# Altium schematic sheet Controller2.SchDoc
size 420 x 297 mm; SheetNumber: 1; SheetTotal: 1
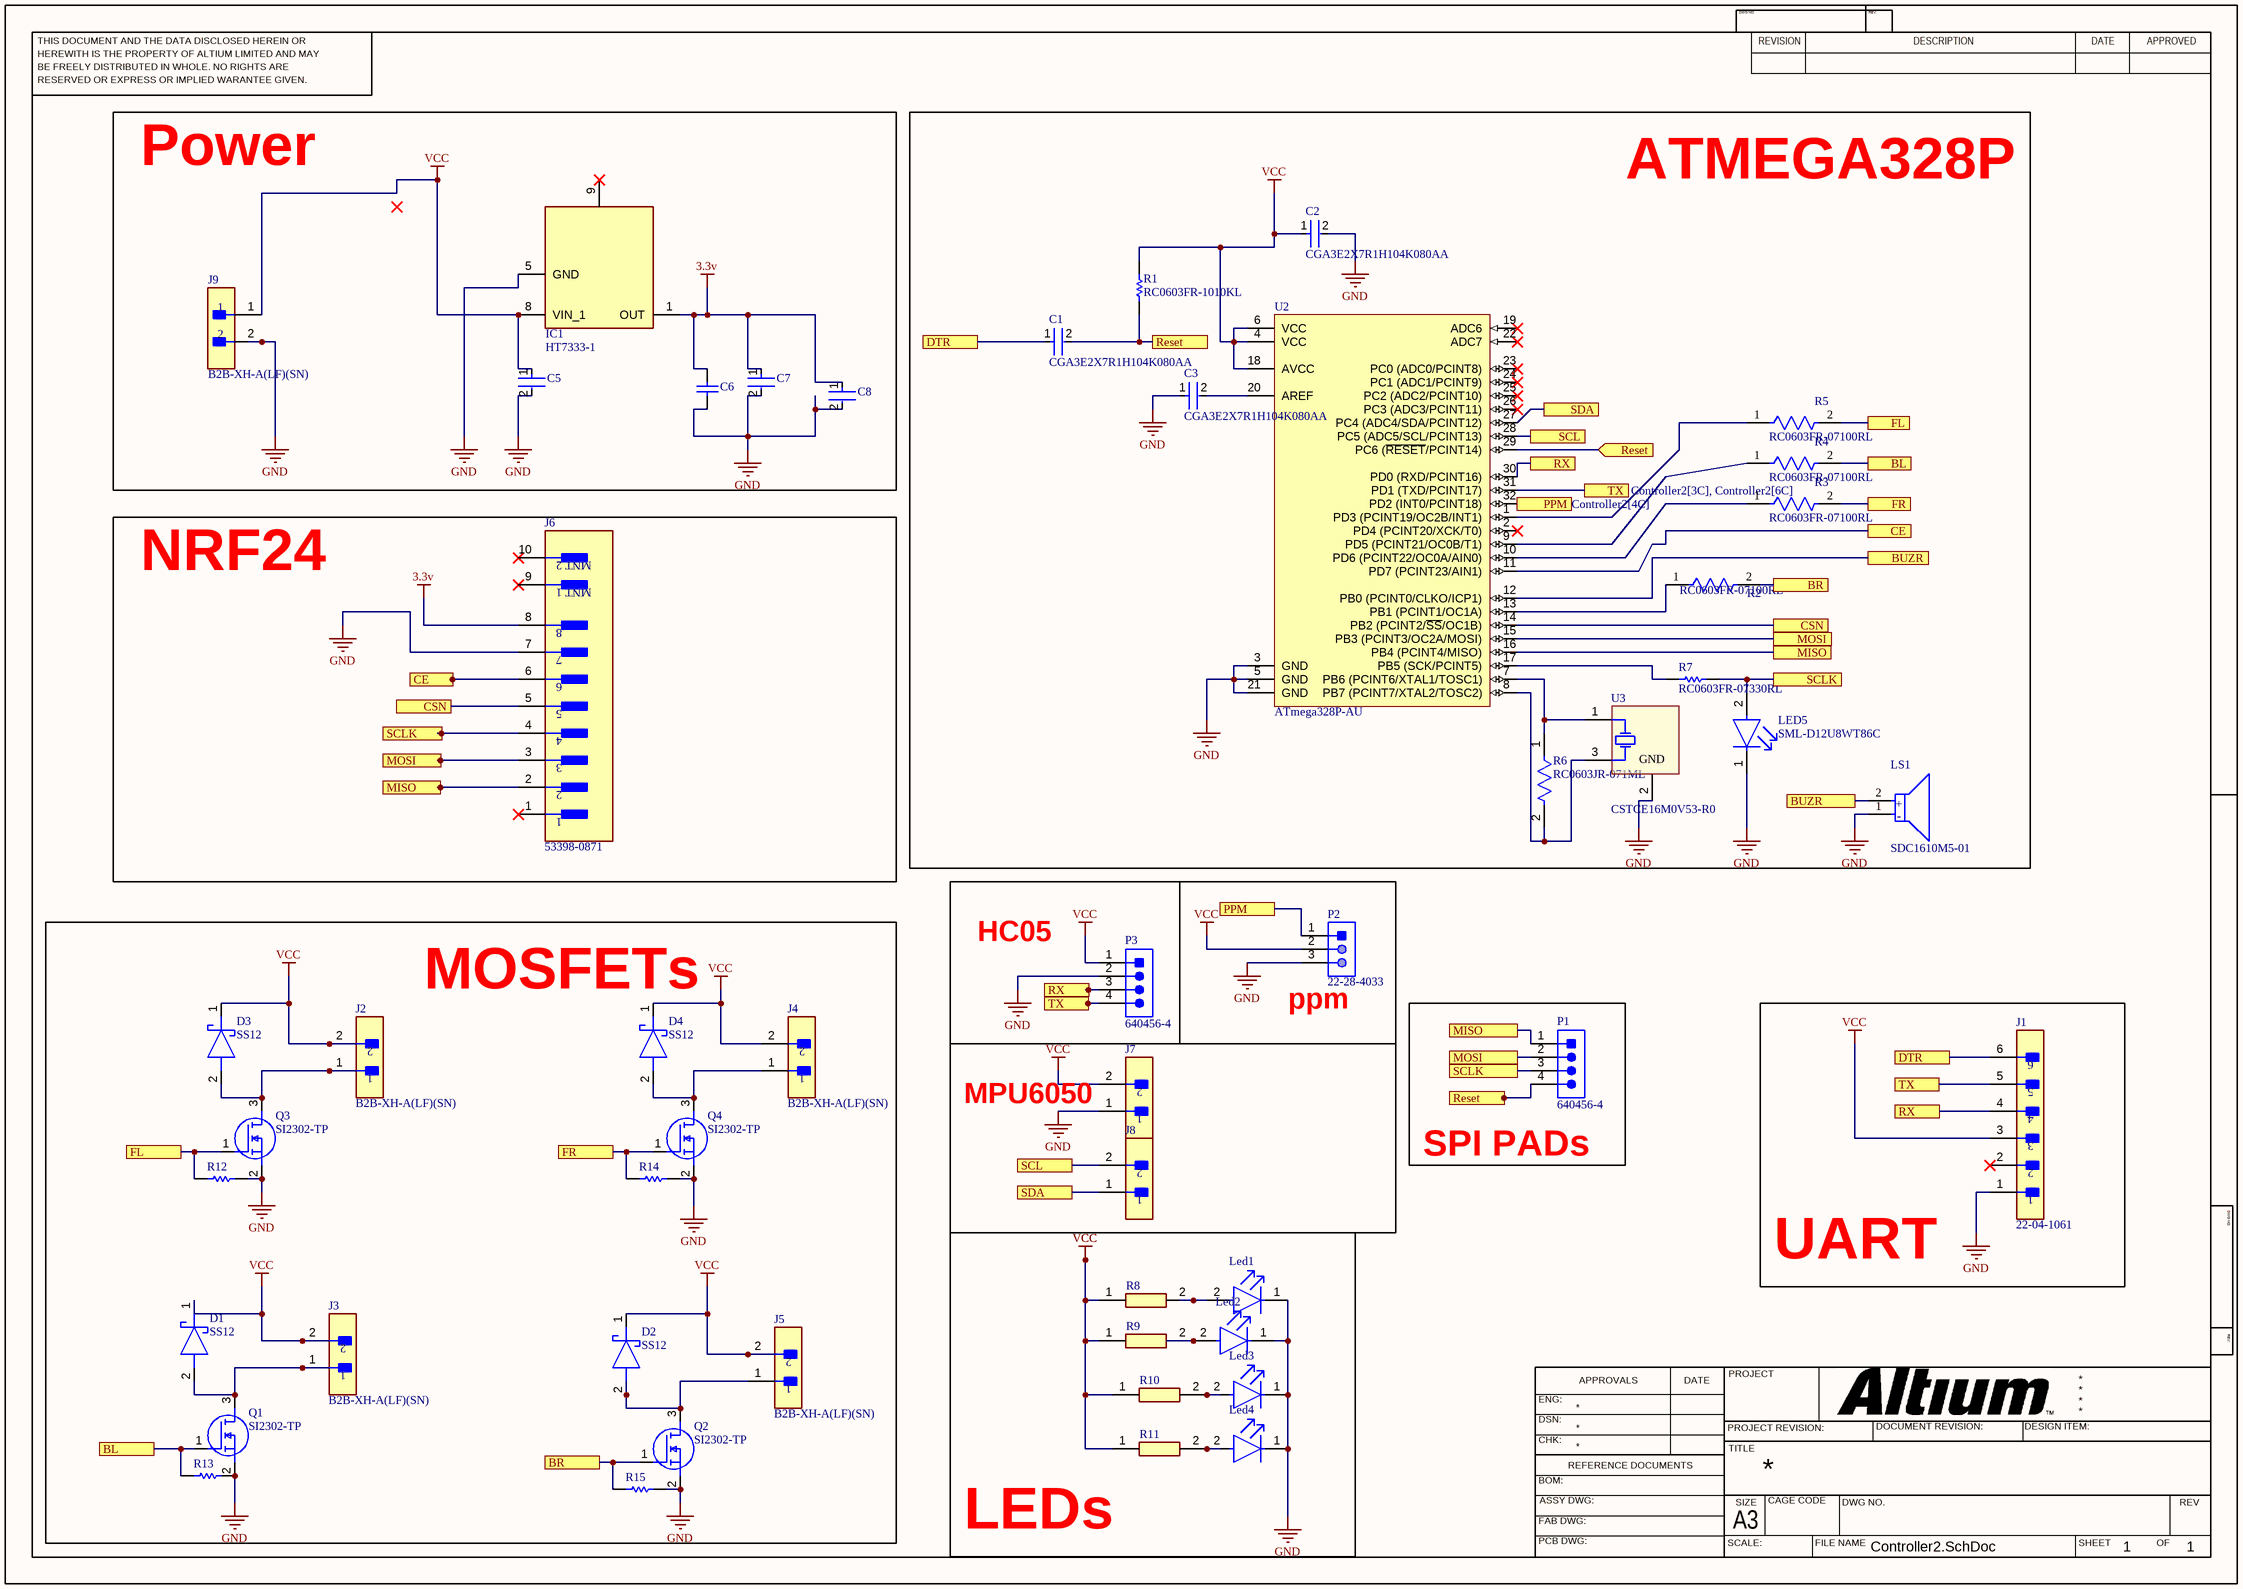
[diagram p0: Controller2.SchDoc]

## Parts
C1  CGA3E2X7R1H104K080AA  [FP-CGA3E-0_3-0_1-IPC_A]
C2  CGA3E2X7R1H104K080AA  [FP-CGA3E-0_3-0_1-IPC_A]
C3  CGA3E2X7R1H104K080AA  [FP-CGA3E-0_3-0_1-IPC_A]
C5  GRM188R60J106ME47D  [FP-GRM188-0_1-e0_2_0_55-IPC_A]  (value not drawn)
C6  GRM188R71H104KA93D  [CAPC1608X90X35ML10T15]  (value not drawn)
C7  GRM188R60J106ME47D  [FP-GRM188-0_1-e0_2_0_55-IPC_A]  (value not drawn)
C8  GRM188R60J106ME47D  [FP-GRM188-0_1-e0_2_0_55-IPC_A]  (value not drawn)
D1  SS12  [DIOM5227X250N]
D2  SS12  [DIOM5227X250N]
D3  SS12  [DIOM5227X250N]
D4  SS12  [DIOM5227X250N]
IC1  HT7333-1  [SOIC127P600X175-9N]
J1  22-04-1061  [FP-22-04-1061-MFG]
J2  B2B-XH-A(LF)(SN)  [FP-B2B-XH-A_LF_SN-MFG]
J3  B2B-XH-A(LF)(SN)  [FP-B2B-XH-A_LF_SN-MFG]
J4  B2B-XH-A(LF)(SN)  [FP-B2B-XH-A_LF_SN-MFG]
J5  B2B-XH-A(LF)(SN)  [FP-B2B-XH-A_LF_SN-MFG]
J6  53398-0871  [FP-53398-0871-MFG]
J7  B2B-XH-A(LF)(SN)  [FP-B2B-XH-A_LF_SN-MFG]  (value not drawn)
J8  B2B-XH-A(LF)(SN)  [FP-B2B-XH-A_LF_SN-MFG]  (value not drawn)
J9  B2B-XH-A(LF)(SN)  [FP-B2B-XH-A_LF_SN-MFG]
Led1  SML-D12U8WT86C  [FP-SML-D12-MFG]  (value not drawn)
Led2  SML-D12U8WT86C  [FP-SML-D12-MFG]  (value not drawn)
Led3  SML-D12U8WT86C  [FP-SML-D12-MFG]  (value not drawn)
Led4  SML-D12U8WT86C  [FP-SML-D12-MFG]  (value not drawn)
LED5  SML-D12U8WT86C  [FP-SML-D12-MFG]
LS1  SDC1610M5-01  [FP-SDC1610M5-01-MFG]
P1  640456-4  [TECO-640456-4]
P2  22-28-4033  [MOLX-22-28-4033_V]
P3  640456-4  [TECO-640456-4]
Q1  SI2302-TP  [SOT95P237X125-3N]
Q2  SI2302-TP  [SOT95P237X125-3N]
Q3  SI2302-TP  [SOT95P237X125-3N]
Q4  SI2302-TP  [SOT95P237X125-3N]
R1  RC0603FR-1010KL  [RESC1608X55X25LL10T15]
R2  RC0603FR-07100RL  [FP-RC0603-0_55-MFG]
R3  RC0603FR-07100RL  [FP-RC0603-0_55-MFG]
R4  RC0603FR-07100RL  [FP-RC0603-0_55-MFG]
R5  RC0603FR-07100RL  [FP-RC0603-0_55-MFG]
R6  RC0603JR-071ML  [FP-RC0603-0_55-IPC_C]
R7  RC0603FR-07330RL  [RESC1608X55X25NL10T15]
R8  TFCR0603-16W-E-3300BT  [TFCR0603]  (value not drawn)
R9  TFCR0603-16W-E-3300BT  [TFCR0603]  (value not drawn)
R10  TFCR0603-16W-E-3300BT  [TFCR0603]  (value not drawn)
R11  TFCR0603-16W-E-3300BT  [TFCR0603]  (value not drawn)
R12  CRCW060310K0FKEA  [RESC1609X50X30NL8T20]  (value not drawn)
R13  CRCW060310K0FKEA  [RESC1609X50X30NL8T20]  (value not drawn)
R14  CRCW060310K0FKEA  [RESC1609X50X30NL8T20]  (value not drawn)
R15  CRCW060310K0FKEA  [RESC1609X50X30NL8T20]  (value not drawn)
U2  ATmega328P-AU  [32A_M]
U3  CSTCE16M0V53-R0  [MURA-CSTCE_V-3_V]

## Blocks framed on the sheet
Power: C5-C8 IC1 J9
ATMEGA328P: C1-C3 LED5 LS1 R1-R7 U2 U3
NRF24: J6
MOSFETs: D1-D4 J2-J5 Q1-Q4 R12-R15
SPI PADs: P1
UART: J1
LEDs: Led1-Led4 R8-R11

## Ports
BL (see Controller2[1D]), BL (see Controller2[6B]), BR (see Controller2[2D]), BR (see Controller2[5B]), BUZR (see Controller2[5C]), BUZR (see Controller2[6B]), CE (see Controller2[2B]), CE (see Controller2[6B]), CSN (see Controller2[2B]), CSN (see Controller2[5B]), DTR (see Controller2[3A]), DTR (see Controller2[6C]), FL (see Controller2[1C]), FL (see Controller2[6B]), FR (see Controller2[2C]), FR (see Controller2[6B]), MISO (see Controller2[2B], Controller2[4C]), MISO (see Controller2[2B], Controller2[5B]), MISO (see Controller2[4C], Controller2[5B]), MOSI (see Controller2[2B], Controller2[4C]), MOSI (see Controller2[2B], Controller2[5B]), MOSI (see Controller2[4C], Controller2[5B]), PPM (see Controller2[4C]), PPM (see Controller2[5B]), Reset (in, see Controller2[4A], Controller2[4C]), Reset (see Controller2[4A], Controller2[5B]), Reset (see Controller2[4C], Controller2[5B]), RX (see Controller2[3C], Controller2[5B]), RX (see Controller2[3C], Controller2[6C]), RX (see Controller2[5B], Controller2[6C]), SCL (see Controller2[3C]), SCL (see Controller2[5B]), SCLK (see Controller2[2B], Controller2[4C]), SCLK (see Controller2[2B], Controller2[5B]), SCLK (see Controller2[4C], Controller2[5B]), SDA (see Controller2[3D]), SDA (see Controller2[5B]), TX (see Controller2[3C], Controller2[5B]), TX (see Controller2[3C], Controller2[6C]), TX (see Controller2[5B], Controller2[6C])

## Nets
3.3v: C6.2 C7.1 C8.1 IC1.1(OUT) J6.8
GND: C2.2 C3.1 C5.2 C6.1 C7.2 C8.2 IC1.5(GND) J1.1 J6.7 J7.1 J9.2 Led1.1(C) Led2.1(C) Led3.1(C) Led4.1(C) LED5.1(C) LS1.1(C) P2.3 P3.2 Q1.2(S) Q2.2(S) Q3.2(S) Q4.2(S) R12.2 R13.2 R14.2 R15.2 U2.3(GND) U2.5(GND) U2.21(GND) U3.2(GND)
VCC: C2.1 C5.1 D1.1(K) D2.1(K) D3.1(K) D4.1(K) IC1.8(VIN_1) J1.3 J2.2 J3.2 J4.2 J5.2 J7.2 J9.1 P2.2 P3.1 R1.2 R8.1 R9.1 R10.1 R11.1 U2.4(VCC) U2.6(VCC) U2.18(AVCC)
BL: Q1.1(G) R4.2 R13.1 ; port BL
BR: Q2.1(G) R2.2 R15.1 ; port BR
BUZR: LS1.2(A) U2.12(PB0_(PCINT0/CLKO/ICP1)) ; port BUZR
CE: J6.6 U2.11(PD7_(PCINT23/AIN1)) ; port CE
CSN: J6.5 U2.14(PB2_(PCINT2/~{SS}/OC1B)) ; port CSN
DTR: C1.1 J1.6 ; port DTR
FL: Q3.1(G) R5.2 R12.1 ; port FL
FR: Q4.1(G) R3.2 R14.1 ; port FR
MISO: J6.2 P1.1 U2.16(PB4_(PCINT4/MISO)) ; port MISO
MOSI: J6.3 P1.2 U2.15(PB3_(PCINT3/OC2A/MOSI)) ; port MOSI
PPM: P2.1 U2.32(PD2_(INT0/PCINT18)) ; port PPM
Reset: C1.2 P1.4 R1.1 U2.29(PC6_(~{RESET}/PCINT14)) ; port Reset
RX: J1.4 P3.3 U2.30(PD0_(RXD/PCINT16)) ; port RX
SCL: J8.2 U2.28(PC5_(ADC5/SCL/PCINT13)) ; port SCL
SCLK: J6.4 LED5.2(A) P1.3 R7.2 ; port SCLK
SDA: J8.1 U2.27(PC4_(ADC4/SDA/PCINT12)) ; port SDA
TX: J1.5 P3.4 U2.31(PD1_(TXD/PCINT17)) ; port TX
NetC3_2: C3.2 U2.20(AREF)
NetD1_2: D1.2(A) J3.1 Q1.3(D)
NetD2_2: D2.2(A) J5.1 Q2.3(D)
NetD3_2: D3.2(A) J2.1 Q3.3(D)
NetD4_2: D4.2(A) J4.1 Q4.3(D)
NetLed1_2: Led1.2(A) R8.2
NetLed2_2: Led2.2(A) R9.2
NetLed3_2: Led3.2(A) R10.2
NetLed4_2: Led4.2(A) R11.2
NetR2_1: R2.1 U2.13(PB1_(PCINT1/OC1A))
NetR3_1: R3.1 U2.10(PD6_(PCINT22/OC0A/AIN0))
NetR4_1: R4.1 U2.9(PD5_(PCINT21/OC0B/T1))
NetR5_1: R5.1 U2.1(PD3_(PCINT19/OC2B/INT1))
NetR6_1: R6.1 U2.7(PB6_(PCINT6/XTAL1/TOSC1)) U3.1(C1)
NetR6_2: R6.2 U2.8(PB7_(PCINT7/XTAL2/TOSC2)) U3.3(C2)
NetR7_1: R7.1 U2.17(PB5_(SCK/PCINT5))

Not connected (* = marked no-connect by the designer): IC1 9(VIN_2)*; J1 2*; J6 1* 9(MNT_1)* 10(MNT_2)*; U2 2(PD4_(PCINT20/XCK/T0))* 19(ADC6)* 22(ADC7)* 23(PC0_(ADC0/PCINT8))* 24(PC1_(ADC1/PCINT9))* 25(PC2_(ADC2/PCINT10))* 26(PC3_(ADC3/PCINT11))*

## Notes on the sheet
- HC05
- (near P2) ppm
- MPU6050
- THIS DOCUMENT AND THE DATA DISCLOSED HEREIN OR
- HEREWITH IS THE PROPERTY OF ALTIUM LIMITED AND MAY
- DWG NO:
- REVISION
- REV:
- DESCRIPTION
- DATE
- APPROVED
- BE FREELY DISTRIBUTED IN WHOLE. NO RIGHTS ARE
- RESERVED OR EXPRESS OR IMPLIED WARANTEE GIVEN.
- ENG:
- APPROVALS
- PROJECT
- DSN:
- CHK:
- REFERENCE DOCUMENTS
- PROJECT REVISION:
- TITLE
- DOCUMENT REVISION:
- DESIGN ITEM:
- BOM:
- FAB DWG:
- PCB DWG:
- ASSY DWG:
- SCALE:
- A3
- SIZE
- CAGE CODE
- FILE NAME
- DWG NO.
- SHEET
- OF
- REV
- (in symbol CMP-08413-000008-1) +; -

## Library data of the parts
C1-C3 = CMP-2000-07546-2: Cap Ceramic 100nF 50V X7R 10% Pad SMD 0603 +125°C Automotive T/R; Weight: 7.1E-05oz; Composition: Ceramic; Max Operating Temperature: 125°C; Termination: SMD/SMT; Dielectric: X7R; Length: 1.6mm; Package Quantity: 1; REACH SVHC: No SVHC; Lead Free: Lead Free; Case Code (Metric): 1608; Min Operating Temperature: -55°C; Packaging: Tape and Reel; Tolerance: 10%; Voltage Rating: 50V; Case Code (Imperial): 0603; Capacitance: 100nF; Case/Package: 0603; Voltage Rating (DC): 50V; Depth: 0.8mm; Radiation Hardening: No; Ratings: AEC-Q200; Mount: Surface Mount; Voltage: 50V; Thickness: 0.035inch; Width: 0.8mm; Height: 0.8mm
C5 C7 C8 = CMP-2006-02792-2: Chip Multilayer Ceramic Capacitors for General Purpose, 0603, 10uF, X5R, 15%, 20%, 6.3V; Packaging: Tape and Reel; Voltage Rating (DC): 6.3V; Width: 0.031inch; Termination: SMD/SMT; Dielectric: X5R; Package Quantity: 4000; Voltage Rating: 6.3V; Capacitance: 10uF; Case/Package: 0603; Min Operating Temperature: -55°C; Voltage: 6.3V; Length: 1.6mm; Thickness: 0.035inch; Lead Free: Lead Free; Depth: 0.8mm; Case Code (Imperial): 0603; Max Operating Temperature: 85°C; Material: Ceramic; Height: 0.8mm; Tolerance: 20%; Mount: Surface Mount; REACH SVHC: No SVHC; Radiation Hardening: No; Case Code (Metric): 1608
C6 = CMP-2100-03643-1: Chip Capacitor, 0.1 uF, +/- 10%, 50 V, -55 to 125 degC, 0603 (1608 Metric), RoHS, Tape and Reel; Manufacturer: Murata; Dielectric Material: Ceramic; Voltage Rating: 50V; Capacitance: 100nF; Dielectric: X7R; Insulation Resistance: 10GR; Case Code (Metric): 1608; Lead Free: LeadFree; Depth: 0.8mm; Number of Pins: 2; Radiation Hardening: No; Case/Package: 0603; Manufacturer URL: http://www.murata.com/; Packaging: TapeandReel; Length: 1.6mm; Contact Plating: Tin; Datasheet URL: http://psearch.en.murata.com/capacitor/product/GRM188R71H104KA93%23.pdf; Tolerance: 10%; Case Code (Imperial): 0603; Min Operating Temperature: -55degC; RoHSCompliant: true; Voltage: 50V; Termination: SMD/SMT; Mount: SurfaceMount; Material: Ceramic; Package Quantity: 1; Height: 0.8mm; Thickness: 0.035inch; REACH SVHC: NoSVHC; Max Operating Temperature: 125degC; Width: 0.8mm; Package Reference: 0603; Voltage Rating (DC): 50V; Datasheet Version: 42675.0; Package Description: 2-Pin Surface Mount Device, Body 1.6 x 0.8 mm
D1-D4 = SS12: Schottky Diode; Manufacturer_Name: onsemi; Datasheet Link: https://datasheet.datasheetarchive.com/originals/distributors/Datasheets-24/DSA-463612.pdf; Height: 2.5mm; Manufacturer_Part_Number: SS12; Mouser Part Number: 512-SS12; Mouser Price/Stock: https://www.mouser.co.uk/ProductDetail/onsemi-Fairchild/SS12?qs=mVVXn4M53U9WoaEpU1CO0A%3D%3D; Arrow Part Number: SS12; Arrow Price/Stock: https://www.arrow.com/en/products/ss12/on-semiconductor?utm_currency=USD&region=nac
IC1 = HT7333-1: Integrated Circuit; Manufacturer_Name: Holtek; Datasheet Link: https://www.holtek.com/webapi/116711/HT73xx-1v120.pdf; Height: 1.75mm; Manufacturer_Part_Number: HT7333-1
J1 = CMP-04776-000934-1: CONN HEADER VERT 6POS 2.5MM; Number of Positions: 6; Contact Resistance: 20mR; Insulation Resistance: 1GR; Glow Wire Compliant: Non-compliant; Current Rating: 3A; Max Voltage Rating (DC): 250.25kV; Voltage Rating (AC): 250V; Connector Type: Male Pin; Gender: Male; Hole Diameter: 1.19mm; Termination: Solder; Number of Circuits: 6; Number of Rows: 1; Mount: Through Hole; Lead Free: Lead Free; Contact Type: Male Pin; Lead Pitch: 2.5mm; Radiation Hardening: No; Packaging: Bulk; Pitch: 2.5mm; Contact Plating: Tin; Housing Color: Natural; Fastening Type: Friction; Contact Gender: Male; Length: 14.5mm; Orientation: Straight; Series: KK® 5045; Number of Contacts: 6; Halogen Free: Low Halogen; Min Operating Temperature: -40°C; Number of Poles: 6; Width: 5.8mm; Housing Material: Nylon; Max Operating Temperature: 105°C; Contact Material: Brass; Flammability Rating: UL94 V-0; Color: Natural; Contact Mating Length: 0.295inch; Working Voltage: 250V; Voltage Rating: 250V; Package Quantity: 1; Height: 11.7mm; Voltage Rating (DC): 250V
J2-J5 J7-J9 = CMP-2000-05888-3: CONN HEADER VERT 2POS 2.5MM; Current Rating: 3A; Voltage Rating: 250V; Number of Contacts: 2; Contact Resistance: 20mR; Wire/Cable Gauge: 22AWG; Insulation Resistance: 1GR; Connector Type: Male Pin; Packaging: Bulk; Contact Material: Brass; Lead Free: Lead Free; Orientation: Straight; Contact Plating: Tin; Max Current Rating: 3A; Termination: Solder; Fastening Type: Detent; Depth: 5.75mm; Housing Material: Polyamide; REACH SVHC: No SVHC; Series: XH; Voltage Rating (AC): 250V; Number of Positions: 2; Color: Natural; Contact Type: Male Pin; Max Voltage Rating (DC): 250V; Pitch: 2.5mm; Lead Pitch: 2.5mm; Mount: Through Hole; Max Operating Temperature: 85°C; Length: 7.4mm; Max Voltage Rating (AC): 250V; Min Operating Temperature: -25°C; Number of Rows: 1; Housing Color: White
J6 = CMP-04776-000009-1: CONN HEADER SMD 8POS 1.25MM; Manufacturer: Molex; Current Rating: 1A; Conn Gender: Male; Number Of Contacts: 8; Standoff Height: 0.05mm; Voltage Rating: 125V; Conn Orientation: Vertical; Package: 0; Lead Free: Yes; Number Of Rows: 1; Device Class L1: Connectors; Pitch: 1.25mm; Temperature Range High: +105°C; Automotive: No; ComponentLink2Description: Datasheet; Temperature Range Low: -40°C; RoHS: TRUE; Mouser Description: Headers & Wire Housings VERTICAL HDR SMT 8P; Ambient Temperature Range Low: -40°C; Octopart: https://octopart.com/53398-0871-molex-655298; Device Class L2: Headers and Wire Housings; Temperature: -40°C to +105°C; Footprint Url: https://www.molex.com/pdm_docs/sd/533980871_sd.pdf; Device Class L3: unset; ComponentLink2URL: https://www.molex.com/pdm_docs/ps/PS-51021-024-001.pdf; Contact Material: Tin,Nickel; Ambient Temperature Range High: +105°C; Height: 4.9mm; Manufacturer Part Number: 53398-0871; Digikey Description: CONN HEADER SMD 8POS 1.25MM; Category: Conn
Led1-Led4 LED5 = CMP-08952-000014-1: LED RED 1608 SMD; Manufacturer: Rohm; Reverse Voltage: 5V; Wavelength: 620nm; Luminous Intensity: 63mcd; Automotive Grade: Grade 3; Forward Voltage: 2.2V; Led Orientation: Top View; Forward Current: 20mA; Power Dissipation: 54mW; Mouser Description: LED Uni-Color Red Automotive 2-Pin Chip 0603(1608Metric) T/R; Colour: Red; ComponentLink2Description: Datasheet; Category: Diode; Package: SML-D12; RoHS: TRUE; Temperature Range Low: -40°C; Lead Free: Yes; Height: 0.65mm; Manufacturer Part Number: SML-D12U8WT86C; Digikey Description: LED RED 1608 SMD; Octopart: https://octopart.com/sml-d12u8wt86c-rohm-77740214; Device Class L3: unset; Temperature Range High: +85°C; Device Class L1: Optoelectronics; ComponentLink2URL: https://fscdn.rohm.com/en/products/databook/datasheet/opto/led/chip_mono/sml-d12x8(c)-e.pdf; Device Class L2: LEDs; Temperature: -40°C to +85°C; Automotive: Yes
LS1 = CMP-08413-000008-1: AUDIO MAGNETIC INDICATOR 4-8V TH; Nominal Supply Voltage (DC): 5V; Input Type: DC; Max Supply Current: 30mA; Number of Terminals/Pins: 2; Frequency: 2.4kHz; Lead Free: Lead Free; Operating Supply Current: 30mA; Sensing Method: Magnetic; Termination: PC Pins; Number of Pins: 2; Mount: Through Hole; Min Operating Temperature: -10°C; Diameter: 16mm; Series: SDC; Max Operating Temperature: 70°C; Packaging: Tray; Voltage Rating: 5V; Height: 10mm
P1 P3 = CMP-2000-05419-1: Male Header, Pitch 2.54 mm, 1 x 4 Position, Height 10.03 mm, Tail Length 3.56 mm, RoHS, Bulk; Manufacturer: TE Connectivity; Material, Housing: Polyester; Primary Type: InterconnectSystem; Mount Angle: Vertical; Color, Housing: White; Current, Rating: 5 / A; Agency Approvals: CSA,UL; Contact Termination Area Plating: Tin; Temperature, Operating: -55to+105 / degC; Standards: RoHSCompliant,ELVCompliant,UL94V-0; Number of Positions: 4; Brand/Series: MTA-100Series; Angle: Straight; Pin Spacing: 0.1 / "; Material, Contact: CopperAlloy; Connector Type: MTA-100; Special Features: Pinstrip; Mounting Hole Size: 0.04 / "; Contact Centerline Spacing: 0.100 / in.; Voltage, Rating: 250 / V; Manufacturer URL: http://www.te.com/; Length, Pin: 0.14 / "; Length, Overall: 0.4 / "; Color: White; Flammability Rating: UL94V-0; Mounting Type: PCMount; Termination: Solder; Datasheet URL: https://datasheet.ciiva.com/16286/eng-ds-82056-mta-0608-16286228.pdf; Number of Contacts: 4; Contact Shape: Square; Contact Mating Area Plating: Tin; Length, Terminal Post: 0.14 / in.; Size, Post: 0.025 / in.; Contact Plating: Tin; Type: PCBPlug; Datasheet Version: Dec-14; Number of Rows: 1
P2 = CMP-1676-00001-5: Male Header, Pitch 2.54 mm, 1 x 3 Position, Height 8.38 mm, Tail Length 3.18 mm, RoHS, Bulk; Manufacturer: Molex; Rows: 1; Voltage Rating: 250 V; Current Rating: 4 A; Min Operating Temperature: 0 degC; Lead Pitch: 0.1 inch; Packaging: Bulk; Contact Finish: Gold; RoHSCompliant: true; Contact Material: Brass; PackageReference: 22-28-4033; REACH SVHC: Unknown; PackageDescription: Male Header, Pitch 2.54 mm, 1 x 3 Position, Height 8.38 mm, Tail Length 3.18 mm; ComponentLink2URL: http://www.molex.com/pdm_docs/sd/022284033_sd.pdf; Height: 8.38 mm; Mounting Technology: Through Hole; ComponentLink1Description: Manufacturer URL; Length: 7.62 mm; Mount: Through Hole; DatasheetVersion: Rev. G, 01/2012; Max Operating Temperature: 75 degC; ComponentLink2Description: Datasheet; Colour: Black; Pins: 3; Contact Plating: Gold; Package Quantity: 1; ComponentLink1URL: http://www.molex.com/
Q1-Q4 = SI2302-TP: MOSFET (N-Channel); Manufacturer_Name: MCC; Datasheet Link: https://www.mccsemi.com/pdf/Products/SI2302(SOT-23).pdf; Height: 1.25mm; Manufacturer_Part_Number: SI2302-TP; Mouser Part Number: 833-SI2302-TP; Mouser Price/Stock: https://www.mouser.co.uk/ProductDetail/Micro-Commercial-Components-MCC/SI2302-TP?qs=SdqRYZZ9IxDSgX7NLuKaFg%3D%3D; Arrow Part Number: SI2302-TP; Arrow Price/Stock: https://www.arrow.com/en/products/si2302-tp/micro-commercial-components?utm_currency=USD&region=asia
R1 = CMP-2000-06948-1: Chip Resistor, 10 kOhm, +/- 1%, 0.1 W, -55 to 155 degC, 0603 (1608 Metric), RoHS, Tape and Reel; Manufacturer: Yageo; Product Length (mm): 1.6mm; Case Style: Molded; Product Depth (mm): 0.8mm; Temperature Coefficient: ±100; Product Height (mm): 0.45mm; Power Rating(s): 1/10W; Resistance: 10kohm; Tolerance (+ or -): 1%; Operating Temp Range: -55Cto155C; Mounting Technology: SurfaceMount; Package / Case: 0603; Datasheet URL: http://www.yageo.com/documents/recent/PYu-RC_Group_51_RoHS_L_7.pdf; Datasheet Version: Rev. 7, 05/2017; Package Description: 2-Pin Surface Mount Device, Body 1.6 x 0.8 mm; Failure Rate: NotRequired; Package Reference: 0603; Termination Style: NotRequired; Manufacturer URL: http://www.yageo.com/; Military Standard: NotRequired; Type: ThickFilm; Packaging: TapeandReel; Construction: Rectangular
R2-R5 = CMP-2100-03663-2: NexarPartId: 55402879; Voltage Rating: 50V; Power Rating: 100mW; Tolerance: 1%; Temperature Coefficient: 100ppm/°C; Resistance: 100Ω; Case/Package: 0603; Military Standard: Not; REACH SVHC: Unknown; Case Code (Metric): 0603; Max Operating Temperature: 155°C; Schedule B: 8533210045, 8533210045; Height: 450µm; Length: 1.6mm; Lead Free: Lead Free; Packaging: Tape & Reel; Case Code (Imperial): 0603; Composition: Thick Film; Min Operating Temperature: -55°C; Voltage Rating (DC): 50V; RoHS: Compliant; Depth: 800µm; Number of Pins: 2; Termination: SMD/SMT; Width: 800µm
R6 = CMP-2000-06953-2: RES SMD 1M OHM 5% 1/10W 0603; Voltage Rating (DC): 50V; Power Rating: 100mW; Temperature Coefficient: 100ppm/°C; Resistance: 1MR; Features: Moisture Resistant; Package Quantity: 5000; Case Code (Imperial): 0603; Packaging: Tape and Reel; Resistor Type: Thick Film; Number of Pins: 2; Size Code: 0603; Resistance Tolerance: 5%; Max Operating Temperature: 155°C; Voltage Rating: 50V; Depth: 0.8mm; Termination: SMD/SMT; Width: 0.8mm; RoHS Compliant: Yes; Number of Terminations: 2; Height: 0.45mm; Lead Free: Lead Free; Case/Package: 0603; Military Standard: Not; Min Operating Temperature: -55°C; Case Code (Metric): 1608; Radiation Hardening: No; Series: RC; Length: 1.6mm; Tolerance: 5%; REACH SVHC: No SVHC; Contact Plating: Tin; Construction: Rectangular; Max Power Dissipation: 100mW
R7 = CMP-1659-00020-2: Chip Resistor, 330 Ohm, +/- 1%, 0.1 W, -55 to 155 degC, 0603 (1608 Metric), RoHS, Tape and Reel; Tolerance: 10%; ESR: 800 mohm; Voltage Rating (DC): 16 V; Capacitance: 47 uF; Length: 7.3 mm; ComponentLink1URL: http://www.yageo.com/; Packaging: Tape and Reel; Pins: 2; ComponentLink1Description: Manufacturer URL; Case Code (Imperial): 2917; REACH SVHC: No SVHC; Width: 4.3 mm; ComponentLink2Description: Datasheet; Voltage Rating: 16 V; RoHSCompliant: True; Max Operating Temperature: 125degC; ComponentLink2URL: http://www.yageo.com/documents/recent/PYu-RC_Group_51_RoHS_L_04.pdf; Min Operating Temperature: -55degC; Case/Package: 2917; Radiation Hardening: No; DatasheetVersion: Rev. 4, 02/2016; Mount: Surface Mount; PackageReference: 0603; Package Quantity: 500; Case Code (Metric): 7343; PackageDescription: 2-Pin Surface Mount Device, Body 1.6 x 0.8 mm; Height: 3.1 mm
R8-R11 = TFCR0603-16W-E-3300BT: Resistor; Manufacturer_Name: Venkel; Datasheet Link: https://page.venkel.com/hubfs/Resources/Datasheets/TFCR-Series.pdf; Height: 0.55mm; Manufacturer_Part_Number: TFCR0603-16W-E-3300BT
R12-R15 = CMP-1666-00005-4: Chip Resistor, 10 KOhm, +/- 1%, 100 mW, -55 to 155 degC, 0603 (1608 Metric), RoHS, Tape and Reel; Manufacturer: Vishay Semiconductor; Voltage Rating: 75 V; Max Operating Temperature: 155 degC; PackageDescription: 2-Pin Surface Mount Device, Body 1.575 x 0.85 mm; ComponentLink1Description: Manufacturer URL; RoHSCompliant: true; PackageReference: 0603; REACH SVHC: Unknown; Length: 1.55 mm; DatasheetVersion: 06/2012; Packaging: Tape and Reel; Min Operating Temperature: -55 degC; Mounting Technology: Surface Mount; ComponentLink2URL: https://datasheet.ciiva.com/11809/0900766b80d98afc-11809037.pdf; Height: 0.45 mm; ComponentLink2Description: Datasheet; Package Quantity: 5000; ComponentLink1URL: http://www.vishay.com/
U2 = CMP-0095-00269-2: 8-bit AVR Microcontroller, 32KB Flash, 1KB EEPROM, 2KB SRAM, 32-pin TQFP, Industrial Grade (-40°C to 85°C); PackageDescription: 32-Lead, 7x7x1.0 mm Body, 0.8mm Lead Pitch, Thin Profile Plastic Quad Flat Package (TQFP); DatasheetVersion: revD, May-2011; RevisionNote: DatasheetVersion & PackageVersion updated. URLs added.; ComponentLink1URL: http://www.atmel.com/; ComponentLink2Description: ATmega48A/48PA/88A/88PA/168A/168PA/328/328P Datasheet; Code_JEDEC: MS-026-ABA; ComponentLink1Description: Manufacturer URL; PackageReference: 32A; ComponentLink3Description: ATmega48A/48PA/88A/88PA/168A/168PA/328/328P Summary; ComponentLink2URL: http://www.atmel.com/dyn/resources/prod_documents/doc8271.pdf; PackageVersion: revC, Oct-2010; ComponentLink3URL: http://www.atmel.com/dyn/resources/prod_documents/8271S.pdf
U3 = CMP-0588-00001-2: Ceramic Resonator, 16 MHz with Built-in Capacitance, Thickness Expander Mode, Initial Frequency Tolerance +/- 0.5%, Load Capacity 15 pF, -20 to 80 degC, 3.2 x 1.3 x 1 mm SMD, RoHS, Reel; Manufacturer: Murata; Oscillating Frequency: 16 MHz; Load Capacity: 15 pF; PackageDescription: 3-Pin SMD, Body 3.2 x 1.3 mm, Pitch 0.95 mm; Mounting Technology: Surface Mount; ComponentLink1URL: http://www.murata.com/; RoHS: TRUE; Packing: Reel; Initial Frequency Tolerance: +/- 0.5%; PartNumber: CSTCE16M0V53-R0; ComponentLink2Description: Datasheet; DatasheetVersion: Rev. P16E-22; PackageReference: CSTCE_V-3; Operating Temperature Range: -20 to 80 degC; ComponentLink2URL: http://www.murata.com/products/catalog/pdf/p16e.pdf; ComponentLink1Description: Manufacturer URL; Initial Tolerance: +/- 0.5%